# EAGLE design Quectel-1280 (EAGLE 7.6.0)
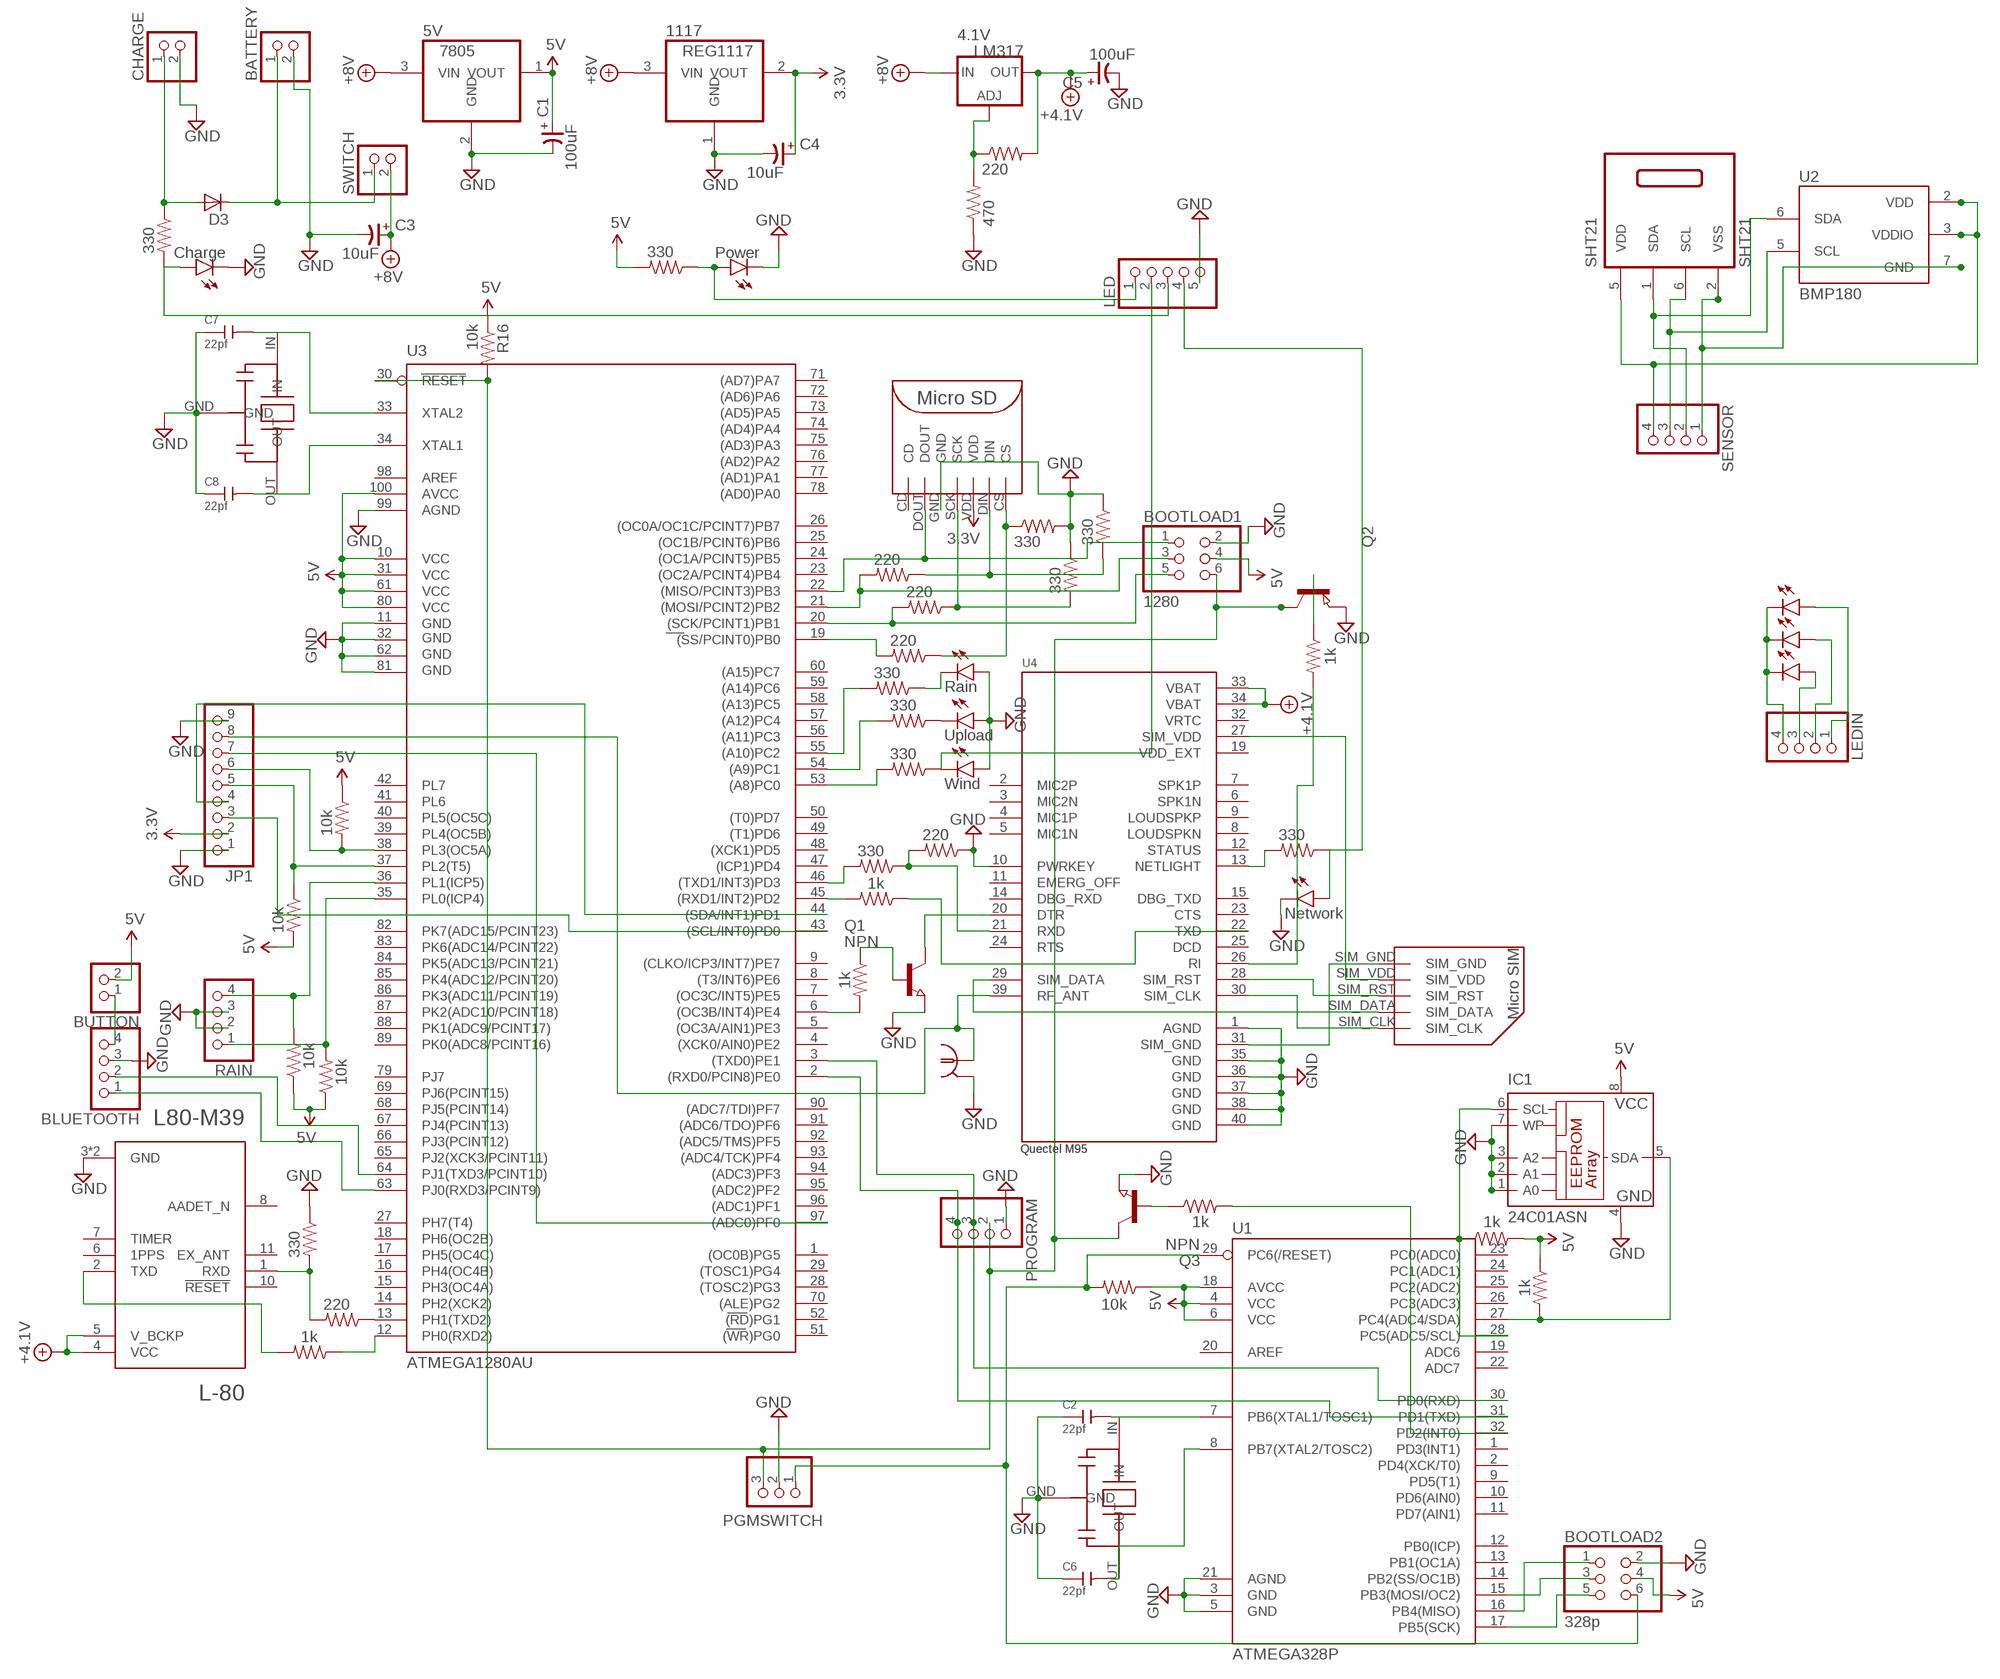
[diagram p0: schematic, sheet 1]

## Parts
4.1V  LM317  LM317MABDT  [DPACK]
5V  7805  REG1118  [SOT223]
1117  REG1117  [SOT223]
ANT  LTI-SASF54GT  [LTI-SASF54GT]
BATTERY  PINHD-1X2  [1X02]
BLUETOOTH  PINHD-1X4  [1X04]
BOOTLOAD1  1280  PINHD-2X3  [2X03]
BOOTLOAD2  328p  PINHD-2X3  [2X03]
BUTTON  PINHD-1X2  [1X02]
C1  100uF  CP-3528  [3528/T]
C2  22pf  CERAMIC-22PF-50V-5%-NPO(0805)  [C0805]
C3  10uF  CP-3528  [3528/T]
C4  10uF  CP-3528  [3528/T]
C5  100uF  CP-3528  [3528/T]
C6  22pf  CERAMIC-22PF-50V-5%-NPO(0805)  [C0805]
C7  22pf  CERAMIC-22PF-50V-5%-NPO(0805)  [C0805]
C8  22pf  CERAMIC-22PF-50V-5%-NPO(0805)  [C0805]
CHARGE  PINHD-1X2  [1X02]
D1  Charge  LED-BLUE1206  [LED-1206]
D2  Rain  LED-BLUE1206  [LED-1206]
D3  BYS10  [SOD106A]
D4  Upload  LED-BLUE1206  [LED-1206]
D5  Power  LED-BLUE1206  [LED-1206]
D6  Network  LED-BLUE1206  [LED-1206]
D7  Wind  LED-BLUE1206  [LED-1206]
D8  LED-BLUE1206  [LED-1206]
D9  LED-BLUE1206  [LED-1206]
D10  LED-BLUE1206  [LED-1206]
IC1  24C01ASN  [SO-08]
JP1  PINHD-1X9  [1X09]
L-80  L80-M39  [QUECTEL_L80-M39]
LED  PINHD-1X5  [1X05]
LEDIN  PINHD-1X4  [1X04]
PGMSWITCH  PINHD-1X3  [1X03]
PROGRAM  PINHD-1X4  [1X04]
Q1  NPN  NPN-TRANSISTOR_SOT23  [SOT23]
Q2  PNP-TRANSISTOR_SOT23  [SOT23]
Q3  NPN  NPN-TRANSISTOR_SOT23  [SOT23]
R1  10k  RESISTOR0805-RES  [0805]
R2  1k  RESISTOR0805-RES  [0805]
R3  1k  RESISTOR0805-RES  [0805]
R4  330  RESISTOR0805-RES  [0805]
R5  1k  RESISTOR0805-RES  [0805]
R6  220  RESISTOR0805-RES  [0805]
R7  220  RESISTOR0805-RES  [0805]
R8  220  RESISTOR0805-RES  [0805]
R9  330  RESISTOR0805-RES  [0805]
R10  220  RESISTOR0805-RES  [0805]
R11  470  RESISTOR0805-RES  [0805]
R12  220  RESISTOR0805-RES  [0805]
R13  1k  RESISTOR0805-RES  [0805]
R14  330  RESISTOR0805-RES  [0805]
R15  1k  RESISTOR0805-RES  [0805]
R16  10k  RESISTOR0805-RES  [0805]
R17  330  RESISTOR0805-RES  [0805]
R18  330  RESISTOR0805-RES  [0805]
R19  10k  RESISTOR0805-RES  [0805]
R20  10k  RESISTOR0805-RES  [0805]
R21  10k  RESISTOR0805-RES  [0805]
R22  10k  RESISTOR0805-RES  [0805]
R23  330  RESISTOR0805-RES  [0805]
R24  330  RESISTOR0805-RES  [0805]
R25  330  RESISTOR0805-RES  [0805]
R26  330  RESISTOR0805-RES  [0805]
R27  330  RESISTOR0805-RES  [0805]
R28  330  RESISTOR0805-RES  [0805]
R29  220  RESISTOR0805-RES  [0805]
R30  1k  RESISTOR0805-RES  [0805]
R31  1k  RESISTOR0805-RES  [0805]
RAIN  PINHD-1X4  [1X04]
SENSOR  PINHD-1X4  [1X04]
SHT21  SHT21  [DFN6/SHT]
SWITCH  PINHD-1X2  [1X02]
U1  ATMEGA328P  ATMEGA328P_TQFP  [TQFP32-08]
U2  BMP180  [BMP180]
U3  ATMEGA1280AU  ATMEGA2560AU  [TQFP100]
U4  Quectel M95  M95  [XCVR_M95]
U$1  MICROSD  [MICROSD]
U$2  MICROSIM  [MICROSIM]
Y1  CSTCE16M0V53-R0  [CFP95P160X100-3N]
Y2  CSTCE16M0V53-R0  [CFP95P160X100-3N]

## Nets
3.3V: 1117.2(VOUT) C4.+ JP1.2 U$1.VDD
5V: 5V.1(VOUT) BOOTLOAD1.4 BOOTLOAD2.4 BUTTON.2 C1.+ IC1.8(VCC) R1.1 R5.1 R16.1 R18.2 R19.1 R20.2 R21.1 R22.1 R30.2 U1.4(VCC) U1.6(VCC) U1.18(AVCC) U3.10(VCC) U3.31(VCC1) U3.61(VCC2) U3.80(VCC3) U3.100(AVCC)
+4.1V: 4.1V.4(OUT) C5.+ L-80.4(VCC) L-80.5(V_BCKP) R10.2 U4.33(VBAT) U4.34(VBAT)
+8V: 4.1V.3(IN) 5V.3(VIN) 1117.3(VIN) C3.+ SWITCH.2
GND: 5V.2(GND) 1117.1(GND) ANT.2 ANT.3 ANT.4 ANT.5 BATTERY.2 BLUETOOTH.3 BOOTLOAD1.2 BOOTLOAD2.2 C1.- C2.1 C3.- C4.- C5.- C6.1 C7.1 C8.1 CHARGE.2 D1.C D2.A D4.A D5.C D6.C D7.A IC1.1(A0) IC1.2(A1) IC1.3(A2) IC1.4(GND) IC1.7(WP) JP1.1 JP1.9 L-80.3(GND) L-80.12(GND) LED.5 PGMSWITCH.2 PROGRAM.1 Q1.2(E) Q2.2(E) Q3.2(E) R4.1 R9.1 R11.1 R23.2 R24.1 R29.1 RAIN.2 RAIN.3 U1.3(GND) U1.5(GND) U1.21(AGND) U3.11(GND) U3.32(GND1) U3.62(GND2) U3.81(GND3) U3.99(AGND) U4.1(AGND) U4.10(PWRKEY) U4.35(GND) U4.36(GND) U4.37(GND) U4.38(GND) U4.40(GND) U$1.GND Y1.GND Y2.GND
GNDLED: D8.C D9.C D10.C LEDIN.4
GNDSENSOR: SENSOR.1 SHT21.2(VSS) U2.7(GND)
N$1: U4.31(SIM_GND) U$2.SIM_GND
N$2: U4.27(SIM_VDD) U$2.SIM_VDD
N$3: U4.28(SIM_RST) U$2.SIM_RST
N$4: U4.29(SIM_DATA) U$2.SIM_DATA
N$5: ANT.1 JP1.8 U4.39(RF_ANT)
N$6: U4.30(SIM_CLK) U$2.SIM_CLK
N$7: L-80.2(TXD) R13.2
N$8: PROGRAM.4 U1.31(PD1(TXD)) U3.2((RXD0/PCIN8)PE0)
N$9: PROGRAM.3 U1.30(PD0(RXD)) U3.3((TXD0)PE1)
N$10: R7.1 R24.2 U$1.SCK
N$11: BOOTLOAD1.1 U3.22((MISO/PCINT3)PB3) U$1.DOUT
N$12: R6.1 R9.2 U$1.DIN
N$13: C2.2 U1.7(PB6(XTAL1/TOSC1)) Y1.IN
N$14: R2.2 U3.6((OC3B/INT4)PE4)
N$15: Q1.1(B) R2.1
N$16: BOOTLOAD1.3 R6.2 U3.21((MOSI/PCINT2)PB2)
N$17: BOOTLOAD1.5 R7.2 U3.20((SCK/PCINT1)PB1)
N$18: R3.2 U4.26(RI)
N$19: BATTERY.1 D3.K SWITCH.1
N$20: R8.2 U3.19((SS/PCINT0)PB0)
N$21: BOOTLOAD2.1 U1.16(PB4(MISO))
N$22: BOOTLOAD2.3 U1.15(PB3(MOSI/OC2))
N$23: BOOTLOAD2.5 U1.17(PB5(SCK))
N$24: C6.2 U1.8(PB7(XTAL2/TOSC2)) Y1.OUT
N$25: CHARGE.1 D3.A R26.1
N$26: BOOTLOAD2.6 PGMSWITCH.1 R1.2 U1.29(PC6(/RESET))
N$27: D1.A LED.3 R26.2
N$28: Q2.1(B) R3.1
N$29: 4.1V.1(ADJ) R10.1 R11.2
N$30: C7.2 U3.33(XTAL2) Y2.IN
N$31: C8.2 U3.34(XTAL1) Y2.OUT
N$32: D7.C LED.2 R28.1
N$33: D4.C R25.1
N$34: D2.C R27.1
N$35: R8.1 R23.1 U$1.CS
N$36: R12.1 U3.13(PH1(TXD2))
N$37: R13.1 U3.12(PH0(RXD2))
N$38: L-80.1(RXD) R4.2 R12.2
N$39: R28.2 U3.53((A8)PC0)
N$40: R14.2 U3.46((TXD1/INT3)PD3)
N$41: R15.2 U3.45((RXD1/INT2)PD2)
N$42: R14.1 R29.2 U4.21(RXD)
N$43: R15.1 U4.22(TXD)
N$44: IC1.5(SDA) R5.2 U1.27(PC4(ADC4/SDA))
N$45: R25.2 U3.54((A9)PC1)
N$46: Q1.3(C) U4.20(DTR)
N$47: BOOTLOAD1.6 PGMSWITCH.3 PROGRAM.2 Q2.3(C) Q3.3(C) R16.2 U3.30(RESET)
N$48: R27.2 U3.55((A10)PC2)
N$49: IC1.6(SCL) R30.1 U1.28(PC5(ADC5/SCL))
N$50: R17.2 U4.13(NETLIGHT)
N$51: D6.A LED.4 R17.1
N$52: Q3.1(B) R31.1
N$53: JP1.3 U3.43((SCL/INT0)PD0)
N$54: JP1.4 U3.44((SDA/INT1)PD1)
N$55: JP1.5 R20.1 U3.37(PL2(T5))
N$56: JP1.6 R19.2 U3.38(PL3(OC5A))
N$57: JP1.7 U3.97((ADC0)PF0)
N$58: R21.2 RAIN.4 U3.36(PL1(ICP5))
N$59: R22.2 RAIN.1 U3.35(PL0(ICP4))
N$60: D5.A LED.1 R18.1
N$61: R31.2 U1.32(PD2(INT0))
N$62: BLUETOOTH.2 U3.64(PJ1(TXD3/PCINT10))
N$63: SENSOR.2 SHT21.1(SDA) U2.6(SDA)
N$64: SENSOR.3 SHT21.6(SCL) U2.5(SCL)
N$65: SENSOR.4 SHT21.5(VDD) U2.2(VDD) U2.3(VDDIO)
N$66: BLUETOOTH.1 U3.63(PJ0(RXD3/PCINT9))
N$67: D10.A LEDIN.3
N$68: D8.A LEDIN.2
N$69: D9.A LEDIN.1
N$70: BLUETOOTH.4 BUTTON.1
Unconnected: L-80.6(1PPS) L-80.7(TIMER) L-80.8(AADET_N) L-80.10(!RESET) L-80.11(EX_ANT) U1.1(PD3(INT1)) U1.2(PD4(XCK/T0)) U1.9(PD5(T1)) U1.10(PD6(AIN0)) U1.11(PD7(AIN1)) U1.12(PB0(ICP)) U1.13(PB1(OC1A)) U1.14(PB2(SS/OC1B)) U1.19(ADC6) U1.20(AREF) U1.22(ADC7) U1.23(PC0(ADC0)) U1.24(PC1(ADC1)) U1.25(PC2(ADC2)) U1.26(PC3(ADC3)) U3.1((OC0B)PG5) U3.4((XCK0/AIN0)PE2) U3.5((OC3A/AIN1)PE3) U3.7((OC3C/INT5)PE5) U3.8((T3/INT6)PE6) U3.9((CLKO/ICP3/INT7)PE7) U3.14(PH2(XCK2)) U3.15(PH3(OC4A)) U3.16(PH4(OC4B)) U3.17(PH5(OC4C)) U3.18(PH6(OC2B)) U3.23((OC2A/PCINT4)PB4) U3.24((OC1A/PCINT5)PB5) U3.25((OC1B/PCINT6)PB6) U3.26((OC0A/OC1C/PCINT7)PB7) U3.27(PH7(T4)) U3.28((TOSC2)PG3) U3.29((TOSC1)PG4) U3.39(PL4(OC5B)) U3.40(PL5(OC5C)) U3.41(PL6) U3.42(PL7) U3.47((ICP1)PD4) U3.48((XCK1)PD5) U3.49((T1)PD6) U3.50((T0)PD7) U3.51((WR)PG0) U3.52((RD)PG1) U3.56((A11)PC3) U3.57((A12)PC4) U3.58((A13)PC5) U3.59((A14)PC6) U3.60((A15)PC7) U3.65(PJ2(XCK3/PCINT11)) U3.66(PJ3(PCINT12)) U3.67(PJ4(PCINT13)) U3.68(PJ5(PCINT14)) U3.69(PJ6(PCINT15)) U3.70((ALE)PG2) U3.71((AD7)PA7) U3.72((AD6)PA6) U3.73((AD5)PA5) U3.74((AD4)PA4) U3.75((AD3)PA3) U3.76((AD2)PA2) U3.77((AD1)PA1) U3.78((AD0)PA0) U3.79(PJ7) U3.82(PK7(ADC15/PCINT23)) U3.83(PK6(ADC14/PCINT22)) U3.84(PK5(ADC13/PCINT21)) U3.85(PK4(ADC12/PCINT20)) U3.86(PK3(ADC11/PCINT19)) U3.87(PK2(ADC10/PCINT18)) U3.88(PK1(ADC9/PCINT17)) U3.89(PK0(ADC8/PCINT16)) U3.90((ADC7/TDI)PF7) U3.91((ADC6/TDO)PF6) U3.92((ADC5/TMS)PF5) U3.93((ADC4/TCK)PF4) U3.94((ADC3)PF3) U3.95((ADC2)PF2) U3.96((ADC1)PF1) U3.98(AREF) U4.2(MIC2P) U4.3(MIC2N) U4.4(MIC1P) U4.5(MIC1N) U4.6(SPK1N) U4.7(SPK1P) U4.8(LOUDSPKN) U4.9(LOUDSPKP) U4.11(EMERG_OFF) U4.12(STATUS) U4.14(DBG_RXD) U4.15(DBG_TXD) U4.23(CTS) U4.24(RTS) U4.25(DCD) U$1.CD

## Power pins joined to a net without a drawn wire
VDD_EXT: U4.19(VDD_EXT)
VRTC: U4.32(VRTC)

## Library data of the parts
4.1V = v-reg:LM317?*: 500 mA Adjustable Output Positive Voltage Regulator Source: http://www.onsemi.co.jp .. LM317M-D.PDF
5V = burr-brown:REG1118: 800mA Low Dropout (LDO) Positive Regulator with Current Source and Sink Capability; MPN: 7805; OC_FARNELL: unknown; OC_NEWARK: 14M2185
1117 = burr-brown:REG1117: 800mA and 1A Low Dropout (LDO) Positive Regulator 1.8V, 2.5V, 2.85V, 3.3V, 5V, and Adj; MPN: REG1117; OC_FARNELL: 1097566; OC_NEWARK: 14P6981
ANT = con-coax:LTI-SASF54GT: SMA vertical PCB thrue hole jack Source: Lighthorse Technologies, inc. SASF54GT.pdf; OC_FARNELL: unknown; OC_NEWARK: unknown
BATTERY BUTTON CHARGE SWITCH = pinhead:PINHD-1X2: PIN HEADER
BLUETOOTH LEDIN PROGRAM RAIN SENSOR = pinhead:PINHD-1X4: PIN HEADER
BOOTLOAD1 BOOTLOAD2 = pinhead:PINHD-2X3: PIN HEADER
C1 C3-C5 = cap-master:CP-: POLARIZED CAP
C2 C6-C8 = Seeed-OPL-Capacitor:CERAMIC-22PF-50V-5%-NPO(0805): 302010151; MPN: CC0805JRNPO9BN220
D1 D2 D4-D10 = SparkFun-LED:LED-BLUE: Blue LEDs for production use Various blue LEDs stocked by SparkFun production 0603 - DIO-08575 Rebel - DIO-09553 1206 - DIO-09911; PROD_ID: DIO-09911; VALUE: BLUE
D3 = telefunken:BYS10: DIODE; MPN: BYS10/45; OC_FARNELL: 9549188; OC_NEWARK: 96K7236
IC1 = microchip:24C*: Serial EEPROM 1 K/2 K/4 K; MPN: AT24C01BN-SH-B; OC_FARNELL: 1362638; OC_NEWARK: 50M3313
JP1 = pinhead:PINHD-1X9: PIN HEADER
L-80 = L80-M39:L80-M39: GPS Receiver 1575.42MHz 3.3V 12-Pin
LED = pinhead:PINHD-1X5: PIN HEADER
PGMSWITCH = pinhead:PINHD-1X3: PIN HEADER
Q1 Q3 = semicon-smd-ipc:NPN-TRANSISTOR_: NPN TRANSISTOR
Q2 = semicon-smd-ipc:PNP-TRANSISTOR_: PNP TRANSISTOR
R1-R31 = SparkFun-Resistors:RESISTOR: Resistor Basic schematic elements and footprints for 0603, 1206, and PTH resistors.
SHT21 = sensirion:SHT21: Humidity and Temperature Sensor
U1 = SparkFun-DigitalIC:ATMEGA328P_TQFP; PROD_ID: IC-09069; VALUE: ATMEGA328P_TQFP
U2 = SparkFun-Sensors:BMP180: BOSCH BMP180 DIGITAL BAROMETRIC PRESSURE SENSOR Web page: http://www.bosch-sensortec.com/en/homepage/products_3/environmental_sensors_1/bmp180_1/bmp180 Datasheet: http://ae-bst.resource.bosch.com/media/products/dokumente/bmp180/BST-BMP180-DS000-09.pdf The BMP180 is the function compatible successor of the BMP085, a new generation of high precision digital pressure sensors for consumer applications. The ultra-low power, low voltage electronics of the BMP180 is optimized for use in mobile phones, PDAs, GPS navigation devices and outdoor equipment. With a low altitude noise of merely 0.25m at fast conversion time, the BMP180 offers superior performance. The I2C interface allows for easy system integration with a microcontroller. The BMP180 is based on piezo-resistive technology for EMC robustness, high accuracy and linearity as well as long term stability. Key features: - Temperature measurement included - I2C interface - Fully calibrated - Pb-free, halogen-free and RoHS compliant, - MSL 1 Basic specs: Pressure range: 300 to 1100hPa (+9000m to -500m relating to sea level) Supply voltage: 1.8 to 3.6V (VDD), 1.62V to 3.6V (VDDIO) Package: LGA package with metal lid Small footprint: 3.6mm x 3.8mm Super-flat: 0.93mm height Low power: 5μA at 1 sample / sec. in standard mode Low noise: 0.06hPa (0.5m) in ultra low power mode, 0.02hPa (0.17m) advanced resolution mode Typical applications: - Enhancement of GPS navigation (dead-reckoning, slope detection, etc.) - In- and out-door navigation - Leisure and sports - Weather forecast - Vertical velocity indication (rise/sink speed)
U3 = SparkFun-DigitalIC:ATMEGA2560: Atmel 100-pin 8-bit uC 64/128/256 Kbytes FLASH 4 Kbytes EEPROM 8 Kbytes SRAM 86 General Purpose I/O pins 12-channels16-bit PWM 4 x Serial USARTs 16-channels 10-bit A/D; PROD_ID: IC-10040
U4 = M95:M95: Quad-Band GSM/GPRS Module LCC
U$1 = MicroSD:MICROSD
U$2 = MicroSD:MICROSIM
Y1 Y2 = smd-crystal:CSTCE16M0V53-R0: Ceramic Resonator 16MHz ±0.5% (Tol) ±0.3% (Stability) 15pF 40Ohm 3-Pin CSMD T/R

## Net classes
0 default: clearance 0.205 mm

## Board
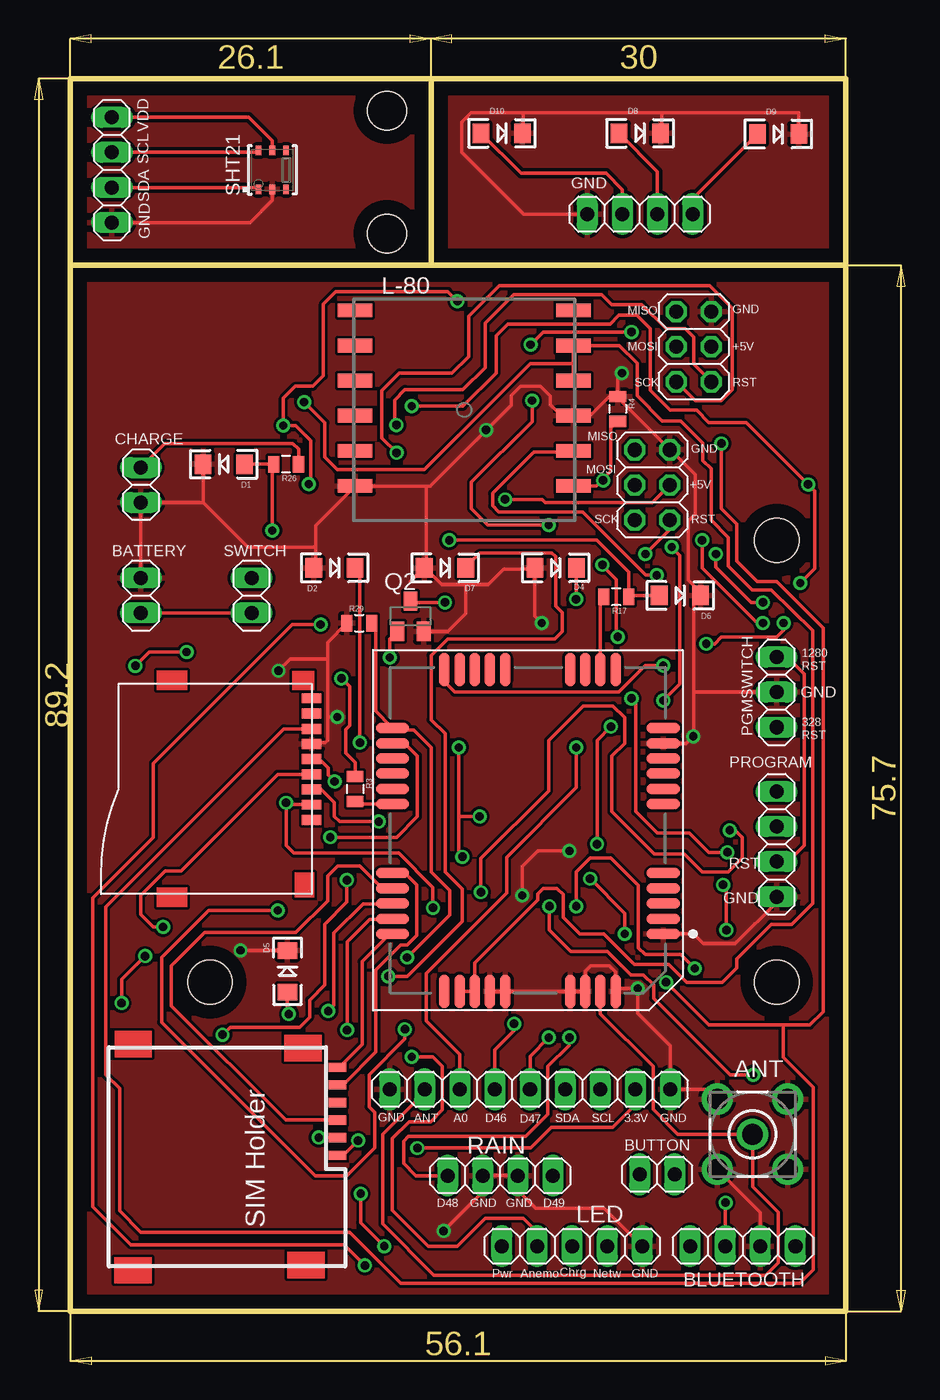
[diagram p1: board, top side]
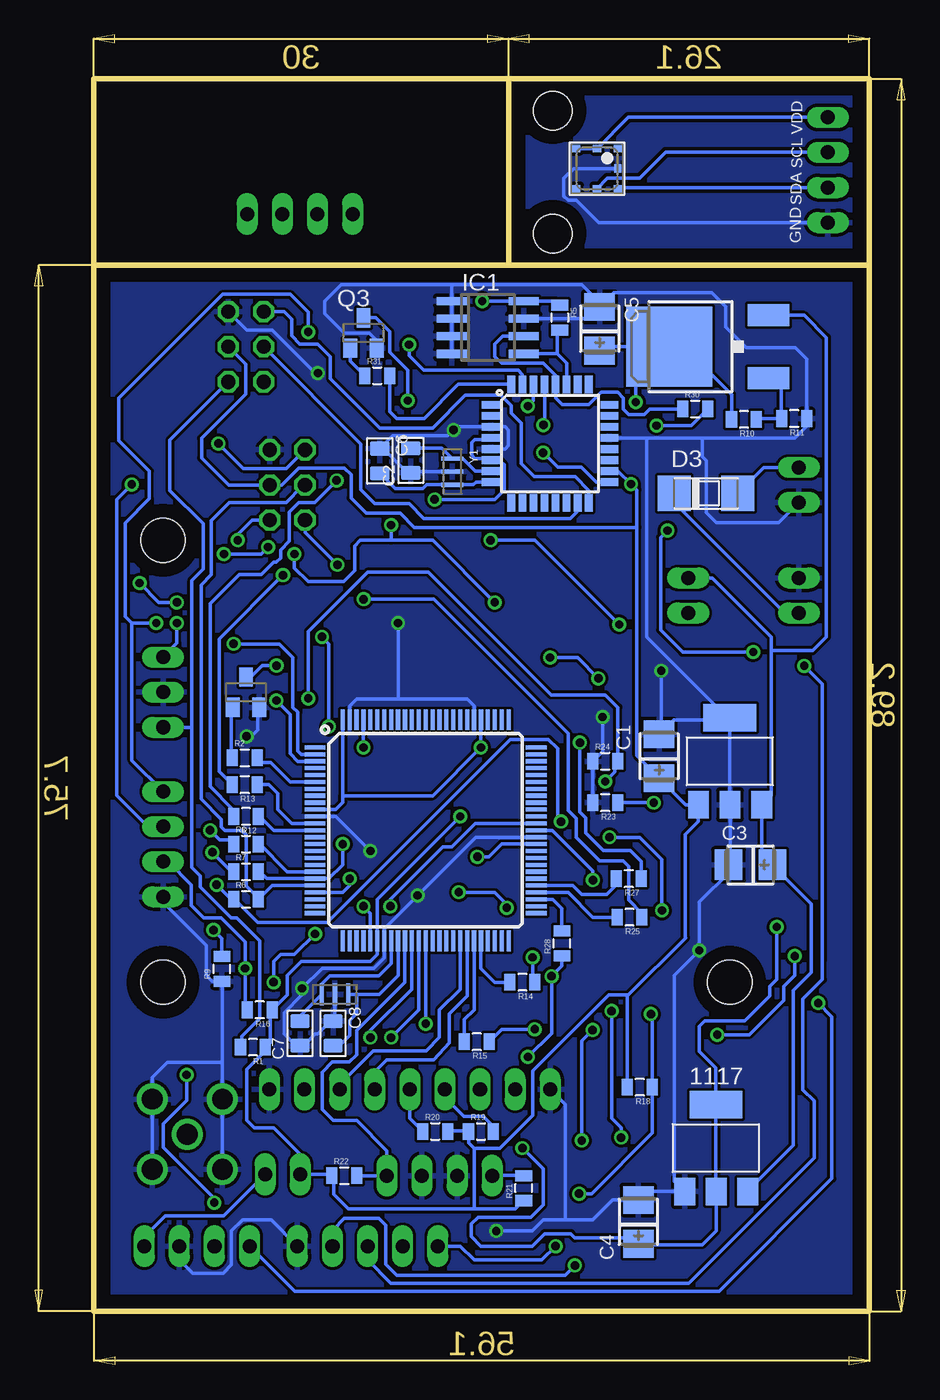
[diagram p2: board, bottom side, seen from below]

Size 56.1 x 89.2 mm. Coordinates in mm from the lower left corner, seen from the top.
Outline: 56.1,75.7 56.1,0 0,0 0,75.7
Outline: 0,75.7 26.1,75.7
Outline: 26.1,75.7 56.1,75.7
Outline: 56.1,75.7 56.1,89.2 26.1,89.2
Outline: 26.1,89.2 0,89.2 0,75.7
Outline: 26.1,75.7 26.1,89.2
Copper layers (1*16): Top 0.035mm / dielectric 1.5mm / Bottom 0.035mm
Design rules "default": minimum track width 10mil, minimum drill 24mil, track to track 8mil, track to pad 8mil, pad to pad 8mil, via to via 8mil, smd to smd 8mil, copper to edge 40mil, drill to drill 8mil, minimum pad ring 10mil, minimum via ring 8mil, stop-mask expansion 4mil, vias tented up to drill 0mil, thermal gap 10mil
Holes 3.2 mm at 10.1,23.8 51.1,55.8 51.1,23.8
Holes 2.8 mm at 22.9,86.9 22.9,78

### Footprints (pad centres in the part's own frame; a part is rotated, then mirrored left to right if it is on the bottom)
DPACK = smd 1.6 x 3: 1 -2.28,-4.8; 3 2.28,-4.8 | smd 5.8 x 6.2: 4 0,2.38
SOT223 = smd 1.499 x 2.007: 1 -2.261,-3.15; 2 0.025,-3.15; 3 2.311,-3.15 | smd 3.81 x 2.007: 4 0,3.15
LTI-SASF54GT = drill 1.5 pad 2.2: 1 0,0; 2 -2.54,2.54; 3 2.54,2.54; 4 2.54,-2.54; 5 -2.54,-2.54
1X02 = drill 1.016 long: 1 -1.27,0; 2 1.27,0
1X04 = drill 1.016 long: 1 -3.81,0; 2 -1.27,0; 3 1.27,0; 4 3.81,0
2X03 = drill 1.016 octagon: 1 -2.54,-1.27; 2 -2.54,1.27; 3 0,-1.27; 4 0,1.27; 5 2.54,-1.27; 6 2.54,1.27
3528/T = smd 2 x 2.2: + 1.587,0; - -1.587,0
C0805 = smd 1.397 x 1.016: 1 0,0.889; 2 0,-0.889
LED-1206 = smd 1.2 x 1.4: A -1.5,0; C 1.5,0
SOD106A = smd 2.4 x 2.6: A 2.3,0; K -2.3,0
SO-08 = smd 0.6 x 2.2: 1 -1.905,-2.6; 2 -0.635,-2.6; 3 0.635,-2.6; 4 1.905,-2.6; 5 1.905,2.6; 6 0.635,2.6; 7 -0.635,2.6; 8 -1.905,2.6
1X09 = drill 1.016 long: 1 -10.16,0; 2 -7.62,0; 3 -5.08,0; 4 -2.54,0; 5 0,0; 6 2.54,0; 7 5.08,0; 8 7.62,0; 9 10.16,0
QUECTEL_L80-M39 = smd 2.5 x 1: 1 7.9,-5.5; 2 7.9,-2.96; 3 7.9,-0.42; 4 7.9,2.12; 5 7.9,4.66; 6 7.9,7.2; 7 -7.9,7.2; 8 -7.9,4.66; 9 -7.9,2.12; 10 -7.9,-0.42; 11 -7.9,-2.96; 12 -7.9,-5.5
1X05 = drill 1.016 long: 1 -5.08,0; 2 -2.54,0; 3 0,0; 4 2.54,0; 5 5.08,0
1X03 = drill 1.016 long: 1 -2.54,0; 2 0,0; 3 2.54,0
SOT23 = smd 1 x 1.4: 1 -0.95,-1.1; 2 0.95,-1.1; 3 0,1.1
0805 = smd 0.8 x 1.2: 1 -0.9,0; 2 0.9,0
DFN6/SHT = smd 0.4 x 0.7: 1 -1,-1.4; 2 0,-1.4; 3 1,-1.4; 4 1,1.4; 5 0,1.4; 6 -1,1.4
TQFP32-08 = smd 1.27 x 0.559: 1 -4.293,2.8; 2 -4.293,2; 3 -4.293,1.2; 4 -4.293,0.4; 5 -4.293,-0.4; 6 -4.293,-1.2; 7 -4.293,-2; 8 -4.293,-2.8; 17 4.293,-2.8; 18 4.293,-2; 19 4.293,-1.2; 20 4.293,-0.4; 21 4.293,0.4; 22 4.293,1.2; 23 4.293,2; 24 4.293,2.8 | smd 0.559 x 1.27: 9 -2.8,-4.293; 10 -2,-4.293; 11 -1.2,-4.293; 12 -0.4,-4.293; 13 0.4,-4.293; 14 1.2,-4.293; 15 2,-4.293; 16 2.8,-4.293; 25 2.8,4.293; 26 2,4.293; 27 1.2,4.293; 28 0.4,4.293; 29 -0.4,4.293; 30 -1.2,4.293; 31 -2,4.293; 32 -2.8,4.293
BMP180 = smd 0.6 x 0.5: 1 1.5,1.45; 2 0,1.45; 3 -1.5,1.45; 4 -1.5,-1.45; 5 0,-1.45; 6 1.5,-1.45 | smd 0.5 x 0.6: 7 1.5,0
TQFP100 = smd 1.5 x 0.3: 1 -8,6; 2 -8,5.5; 3 -8,5; 4 -8,4.5; 5 -8,4; 6 -8,3.5; 7 -8,3; 8 -8,2.5; 9 -8,2; 10 -8,1.5; 11 -8,1; 12 -8,0.5; 13 -8,0; 14 -8,-0.5; 15 -8,-1; 16 -8,-1.5; 17 -8,-2; 18 -8,-2.5; 19 -8,-3; 20 -8,-3.5; 21 -8,-4; 22 -8,-4.5; 23 -8,-5; 24 -8,-5.5; 25 -8,-6; 51 8,-6; 52 8,-5.5; 53 8,-5; 54 8,-4.5; 55 8,-4; 56 8,-3.5; 57 8,-3; 58 8,-2.5; 59 8,-2; 60 8,-1.5; 61 8,-1; 62 8,-0.5; 63 8,0; 64 8,0.5; 65 8,1; 66 8,1.5; 67 8,2; 68 8,2.5; 69 8,3; 70 8,3.5; 71 8,4; 72 8,4.5; 73 8,5; 74 8,5.5; 75 8,6 | smd 0.3 x 1.5: 26 -6,-8; 27 -5.5,-8; 28 -5,-8; 29 -4.5,-8; 30 -4,-8; 31 -3.5,-8; 32 -3,-8; 33 -2.5,-8; 34 -2,-8; 35 -1.5,-8; 36 -1,-8; 37 -0.5,-8; 38 0,-8; 39 0.5,-8; 40 1,-8; 41 1.5,-8; 42 2,-8; 43 2.5,-8; 44 3,-8; 45 3.5,-8; 46 4,-8; 47 4.5,-8; 48 5,-8; 49 5.5,-8; 50 6,-8; 76 6,8; 77 5.5,8; 78 5,8; 79 4.5,8; 80 4,8; 81 3.5,8; 82 3,8; 83 2.5,8; 84 2,8; 85 1.5,8; 86 1,8; 87 0.5,8; 88 0,8; 89 -0.5,8; 90 -1,8; 91 -1.5,8; 92 -2,8; 93 -2.5,8; 94 -3,8; 95 -3.5,8; 96 -4,8; 97 -4.5,8; 98 -5,8; 99 -5.5,8; 100 -6,8
XCVR_M95 = smd 2.4 x 0.75: 1 -9.8,7.5; 2 -9.8,6.4; 3 -9.8,5.3; 4 -9.8,4.2; 5 -9.8,3.1; 6 -9.8,-1.9; 7 -9.8,-3; 8 -9.8,-4.1; 9 -9.8,-5.2; 10 -9.8,-6.3; 11 -9.8,-7.4; 21 9.8,-7.4; 22 9.8,-6.3; 23 9.8,-5.2; 24 9.8,-4.1; 25 9.8,-3; 26 9.8,-1.9; 27 9.8,3.1; 28 9.8,4.2; 29 9.8,5.3; 30 9.8,6.4; 31 9.8,7.5 | smd 0.75 x 2.4: 12 -6.35,-11.65; 13 -5.25,-11.65; 14 -4.15,-11.65; 15 -3.05,-11.65; 16 1.65,-11.65; 17 2.75,-11.65; 18 3.85,-11.65; 19 4.95,-11.65; 20 6.05,-11.65; 32 6.05,11.65; 33 4.95,11.65; 34 3.85,11.65; 35 2.75,11.65; 36 1.65,11.65; 37 -3.05,11.65; 38 -4.15,11.65; 39 -5.25,11.65; 40 -6.35,11.65
MICROSD = smd 1.422 x 0.711: CD -6.35,-6.553; CS -6.35,1.143; DIN -6.35,0.051; DOUT -6.35,-4.343; GND -6.35,-3.251; P$3 -6.35,2.261; P$8 -6.35,-4.343; P$9 -6.35,-4.343; P$10 -6.35,-5.461; SCK -6.35,-2.159; VDD -6.35,-1.041
MICROSIM = smd 0.66 x 1.27: NC -3.29,9.23; SIM_CLK 0.515,9.23; SIM_DATA -0.76,9.23; SIM_GND -5.83,9.23; SIM_RST -2.025,9.23; SIM_VDD -4.565,9.23
CFP95P160X100-3N = smd 0.3 x 1.6: GND 0.038,0.175; IN -0.912,0.177; OUT 0.992,0.174

### Placement (x,y rotation side)
4.1V  12.1,69.8 90 bottom
5V  10.1,39.8 0 bottom
1117  11.1,11.8 0 bottom
ANT  49.35,12.8 0 top
BATTERY  5.1,51.8 90 top
BLUETOOTH  48.65,4.7 0 top
BOOTLOAD1  42.1,59.8 270 top
BOOTLOAD2  45.1,69.8 270 top
BUTTON  42.45,9.9 180 top
C1  15.21,40.16 270 bottom
C2  33.17,61.57 180 bottom
C3  8.6,32.3 0 bottom
C4  16.71,6.46 270 bottom
C5  19.51,71.11 270 bottom
C6  35.42,61.54 0 bottom
C7  41.19,20.1 180 bottom
C8  38.8,20.1 0 bottom
CHARGE  5.1,59.8 270 top
D1  11.1,61.3 180 top
D2  19.1,53.8 0 top
D3  11.81,59.19 0 bottom
D4  35.1,53.8 0 top
D5  15.7,24.6 90 top
D6  44.1,51.8 0 top
D7  27.1,53.8 0 top
D8  41.2,85.25 0 top
D9  51.2,85.2 0 top
D10  31.2,85.25 0 top
IC1  27.6,71.2 270 bottom
JP1  33.25,16.05 180 top
L-80  28.49,65.23 0 top
LED  36.3,4.7 0 top
LEDIN  41.2,79.4 180 top
PGMSWITCH  51.1,44.8 90 top
PROGRAM  51.1,33.8 90 top
Q1  45.1,44.8 0 bottom
Q2  24.6,50.3 0 top
Q3  36.6,70.8 0 bottom
R1  44.6,19.1 180 bottom
R2  45.2,40.05 0 bottom
R3  20.6,37.8 270 top
R4  39.6,65.3 270 top
R5  22.4,71.9 270 bottom
R6  45.1,29.8 0 bottom
R7  45.1,31.8 0 bottom
R8  45.1,33.8 0 bottom
R9  46.85,24.77 90 bottom
R10  9.07,64.54 180 bottom
R11  5.44,64.6 180 bottom
R12  45.1,35.8 180 bottom
R13  45.2,38.1 180 bottom
R14  25.1,23.8 180 bottom
R15  28.4,19.5 180 bottom
R16  44.1,21.8 180 bottom
R17  39.5,51.7 180 top
R18  16.6,16.2 180 bottom
R19  28.1,13 0 bottom
R20  31.4,13 0 bottom
R21  25,8.9 90 bottom
R22  38,9.8 0 bottom
R23  19.1,36.8 180 bottom
R24  19.1,39.8 0 bottom
R25  17.35,28.5 180 bottom
R26  15.6,61.3 180 top
R27  17.4,31.3 180 bottom
R28  22.24,26.61 90 bottom
R29  20.9,49.8 0 top
R30  12.6,65.3 0 bottom
R31  35.6,67.7 0 bottom
RAIN  31.1,9.8 180 top
SENSOR  3,82.6 90 top
SHT21  14.6,82.6 0 top
SWITCH  13.1,51.8 90 top
U1  23.1,62.8 0 bottom
U2  19.7,82.7 0 bottom
U3  32.1,34.8 0 bottom
U4  33.1,34.8 180 top
U$1  11.1,37.8 180 top
U$2  10.1,11.8 270 top
Y1  30.35,60.8 270 bottom
Y2  38.7,22.75 0 bottom

### Tracks (layer width: path | path; a pad name or v marks a point on that pad's centre or on a via)
3.3V  (via drill 0.6)
  Top 0.254: v25.1,11.8 33.3,11.8 34.8,13.3 39.25,13.3 40.87,14.92 JP1.2 | U$1.VDD 14.99,38.84 8.02,31.87 6.87,31.87 5.1,30.1 5.1,28.7 6,27.8 v6.7,27.8
  Bottom 0.254: v25.1,11.8 23.6,10.3 23.6,7.7 24.5,6.8 28.3,6.8 28.8,6.3 28.8,5.4 28.1,4.7 24.4,4.7 23.5,5.6 21.6,5.6 21.3,5.3 17.14,5.3 C4.+ 16.64,4.8 12.1,4.8 11.07,5.82 1117.2 11.1,8.68 11.1,17.6 12.3,18.8 12.3,20.6 11.9,21 9,21 7.2,22.8 7.2,23.5 6.7,24 v6.7,27.8 6.7,27.6
5V  (via drill 0.6, 0.61)
  Top 0.254: v28.1,40.8 28.1,35.8 | v29.6,35.8 28.1,35.8 | v28,73.1 27.3,73.8 19.2,73.8 18.3,72.9 18.3,67.7 17.54,66.94 16.27,66.94 15.4,66.07 v15.4,64.1 16.3,64.1 17.4,63 17.4,60.02 v17.24,59.86 | BOOTLOAD1.4 42.09,58.52 34.35,58.52 34.12,58.75 v31.45,58.75 | 28.1,35.8 28.1,33.14 v28.36,32.88
  Bottom 0.254: 28.71,12.57 28.94,12.8 R19.1 | 25.05,7.77 R21.1 25.6,7.4 28.6,7.4 | 30.54,12.8 R20.2 30.31,13.03 29.16,13.03 R19.1 | U1.4 27.56,63.09 28.55,63.09 28.78,62.86 28.78,61.95 28.55,61.72 27.56,61.72 U1.6 27.34,61.49 26.65,61.49 26.42,61.26 26.42,59.44 27.11,58.75 v31.45,58.75 | 16.82,56.72 16.82,40.23 15.22,38.63 C1.+ 13.29,36.65 5V.1 12.36,35.44 13.3,34.5 13.3,27.02 13.29,27.01 17.5,22.8 | 16.82,56.72 16.82,59.44 v17.24,59.86 18.19,60.81 18.65,60.81 U1.18 | 16.82,56.72 32.92,56.72 33.95,57.75 36.4,57.75 37.5,58.85 37.5,60.55 37.99,61.04 41.28,61.04 42.52,59.8 BOOTLOAD1.4 46.36,59.8 48.32,61.76 48.32,63.18 45.11,66.39 45.11,68.54 BOOTLOAD2.4 | 28.6,7.4 37.7,7.4 38.77,8.47 38.77,9.83 R22.1 38.9,9.9 BUTTON.2 41.18,11.33 43.1,13.25 44.5,13.25 45.05,13.8 45.05,17.49 43.57,18.97 R1.1 43.57,19.2 43.34,19.43 43.34,21.72 R16.1 42.1,22.9 42.1,24.3 41.1,25.3 36.1,25.3 35.6,25.8 U3.31 35.6,29.8 v29.6,35.8 | U3.80 v28.1,40.8 31.6,37.3 38.1,37.3 U3.100 38.1,36.8 38.6,36.3 U3.10 | U3.61 26.6,33.8 27.52,32.88 v28.36,32.88 | 28.6,11.78 28.6,7.4 | v28,73.1 25.7,73.1 IC1.8 22.7,73.1 R5.1 | R30.2 12.9,64.1 v15.4,64.1 | 28.6,11.78 26.76,11.78 24.36,14.17 24.36,17.37 18.84,22.9 17.5,22.9 17.5,22.8 | 28.6,11.78 29,12.18 R19.1 | 17.5,22.8 R18.2
+4.1V  (via drill 0.6)
  Top 0.254: L-80.5 L-80.4 36.48,67.21 36.4,67.29 36.4,68.58 | U4.33 U4.34 29.25,25.2 33.8,29.75 33.8,30.2 34.2,30.6 35.2,30.6 35.65,30.15 35.65,28.5 36.85,27.3 38.6,27.3 40.8,25.1 43.3,25.1 44.6,23.8 47.15,23.8 48.2,24.85 48.2,25.5 50.7,28 52.2,28 53.73,29.53 53.73,49.28 50.7,52.2 49.33,52.2 47.6,53.93 47.6,56 46.35,57.25 46.35,60.97 45.76,61.56 45.76,62.82 44.15,64.43 42.83,64.43 41,66.26 41,68.6 39.7,69.9 L-80.5 36.4,68.58 | v16.9,65.8 18.4,64.3 18.4,61.8 19.3,60.9 25.6,60.9 33.28,68.58 36.4,68.58
  Bottom 0.254: C5.+ 19.23,69.8 16.9,69.8 | 16.9,69.8 4.1V.4 13.42,69.8 9.97,66.35 R10.2 | v16.9,65.8 16.9,69.8
+8V
  Bottom 0.254: SWITCH.2 11.37,53.07 7.1,48.8 7.1,47.8 | 7.1,47.8 7.1,37.34 5V.3 7.79,32.3 C3.+ 4.2,29.49 4.2,24.5 5.5,23.2 5.5,12 8.79,8.71 1117.3 | 6.38,72.08 4.1V.3 4.71,72.08 3.1,70.47 3.1,48.8 4.1,47.8 7.1,47.8
GND  (via drill 0.6, 0.61)
  Top 0.254: BATTERY.2 CHARGE.2 9.6,58.53 | 25.73,59.73 26.03,59.73 v30.08,63.78 31.88,65.58 31.88,66.25 32.59,66.96 33.98,66.96 34.7,66.24 34.7,65.6 35.5,64.8 L-80.3 37.6,64.8 39,66.2 R4.1 | 25.73,59.73 L-80.12 17.73,56.87 17.73,55.3 | U4.35 U4.36 U4.37 U4.38 37.1,23.3 37.25,23.45 37.25,24.6 37.65,25 39,25 39.45,24.55 U4.40 39.65,23.35 v41.05,23.35 41.05,21.55 43.41,19.19 JP1.1 46.1,16.05 ANT.2 | D6.C 45.1,51.3 45.1,44.8 | PGMSWITCH.2 45.1,44.8 | D1.C 9.6,58.53 | 45.2,51.89 D6.C | U$1.GND 17.51,41.15 18.45,41.15 18.6,41.3 18.6,42.9 | 25.73,59.73 25.73,53.95 D7.A | 28.6,52.58 26.88,52.58 25.73,53.72 D7.A | 28.6,52.58 30.21,52.58 31.36,53.72 33.51,53.72 D4.A 33.6,50.3 v34.1,49.8 | 17.73,55.3 17.73,53.95 D2.A | R4.1 39.68,66.06 43.34,62.41 BOOTLOAD1.2 43.57,62.18 45.2,60.55 45.2,57.7 44.7,57.2 44.7,52.9 45.6,52 D6.C | 18.6,42.9 18.6,47.2 | 18.6,47.2 18.6,48.4 R29.1 | 24.6,52.8 D7.A | 9.6,58.53 12.83,55.3 17.73,55.3 | v39.9,67.9 39.6,67.6 R4.1 | Q2.2 27.3,49.2 28.6,50.5 28.6,52.58 | U4.10 44.55,41.1 v45.06,41.61 45.1,41.65 45.1,44.8 | v27,5.8 29.83,8.63 RAIN.3 29.85,9.83 32.37,9.83 RAIN.2 32.37,8.73 33.65,7.45 38.63,7.45 LED.5 | v19.3,43 18.7,43 arc90 18.6,42.9 | 18.6,47.2 15.9,47.2 v15.05,46.35 | v32.68,30.08 32.68,32.18 33.8,33.3 v36.1,33.3 | ANT.5 49.92,7.15 BLUETOOTH.3 | U4.1 45.08,27.3 45.78,26.6 48.11,26.6 51.1,29.59 PROGRAM.1 | D5.C v12.3,26.1
  Bottom 0.254: 12.1,63.2 16.1,63.2 | 16.1,63.2 U1.21 | 10.1,42.8 10.1,36.68 5V.2 10.07,31.83 10.1,31.8 | 10.1,42.8 16.1,48.8 16.1,63.2 | 14.1,9.4 14.1,9.39 1117.1 16.11,8.65 C4.- 18.55,8.05 20,6.6 22,6.6 | 10.1,42.8 14.16,42.8 C1.- 15.05,41.91 v15.05,46.35 | C3.- 10.19,31.89 10.1,31.8 | U3.62 24.14,34.29 28.48,34.29 v32.68,30.08 35.1,27.67 U3.32 | 35.11,26.97 U3.32 | Q1.2 44.25,43.66 44.25,42.06 44.71,41.61 v45.06,41.61 | U1.5 27.34,62.41 26.35,62.41 26.12,62.64 26.12,63.78 26.35,64.01 27.34,64.01 U1.3 27.56,64.01 29.85,64.01 v30.08,63.78 30.49,63.37 34.48,63.37 C6.1 35.18,62.43 33.43,60.68 C2.1 33.09,60.76 Y1.GND | U3.81 28.6,43.8 29.1,44.3 34.1,44.3 | U3.99 37.6,43.8 37.1,44.3 34.1,44.3 | 34.1,44.3 v34.1,49.8 | U3.11 38.6,35.8 v36.1,33.3 | 19.91,72.3 C5.- 18.51,73.7 11.4,73.7 10.4,72.7 10.4,71.21 8.92,69.73 5.37,69.73 4.54,68.9 R11.1 4.54,64.07 5.41,63.2 12.1,63.2 | 19.91,72.3 19.91,73.4 20.81,74.3 30.2,74.3 | IC1.4 IC1.3 IC1.2 IC1.1 30.2,74.3 | 19.91,72.3 20.37,71.83 IC1.7 | 30.2,74.3 38.2,74.3 39.4,73.1 39.4,72.2 38,70.8 36.2,70.8 35.65,70.25 Q3.2 | BOOTLOAD2.2 45.03,71 43.2,71 40.1,67.9 v39.9,67.9 | 14.1,9.4 13.8,9.1 | v27,5.8 24.4,5.8 23.6,6.6 22,6.6 | v19.3,43 19.3,40.5 R24.1 R23.2 | ANT.5 ANT.2 46.81,18 | ANT.4 ANT.3 51.89,16.91 50.8,18 46.81,18 | 43.41,16.94 JP1.1 | JP1.9 22,14.96 22,6.6 | U3.32 35.1,25.55 35.85,24.8 39.6,24.8 v41.05,23.35 41.05,22.9 42.35,21.6 42.35,20.05 41.51,19.21 C7.1 40.94,19.21 40.1,20.05 39.9,20.05 39.25,20.7 39.09,20.7 C8.1 38.66,21.13 Y2.GND | LED.5 43.28,6.6 45.35,6.6 46.15,5.8 46.15,3.35 46.75,2.75 48.95,2.75 49.92,3.72 BLUETOOTH.3 | 12.1,63.2 12.1,61.85 11.8,61.55 11.8,57.8 11.06,57.07 6.57,57.07 CHARGE.2
  Bottom 0.254: 46.81,18 46.81,23.83 R9.1 47.53,23.87 47.99,24.33 47.99,26.48 51.1,29.59 PROGRAM.1 | 14.1,9.4 14.1,24.3 v12.3,26.1 12.3,29.6 10.1,31.8
  pour Bottom: 0,75.7 56.1,75.7 56.1,0 0,0
  pour Top: 0,75.7 56.1,75.7 56.1,0 0,0
GNDLED
  Top 0.254: LEDIN.4 32.8,79.4 28.3,83.9 28.3,86.05 29,86.75 32.75,86.75 | 32.75,86.75 42.8,86.75 | 42.8,86.75 52.7,86.75 D9.C | D8.C 42.8,85.25 42.8,86.75 | D10.C 32.75,85.25 32.75,86.75
  pour Top (isolate 0.254): 26.1,89.2 26.1,75.7 56.1,75.7 56.1,89.2
GNDSENSOR
  Top 0.254: SHT21.2 14.6,80.4 12.99,78.79 SENSOR.1
  Bottom 0.254: U2.7 21.4,82.7 22.1,82 22.1,80.7 21.8,80.4 21.2,80.4 19.59,78.79 SENSOR.1
  pour Top (isolate 0.254): 0,89.2 0,75.7 26.1,75.7 26.1,89.2
  pour Bottom (isolate 0.254): 0,89.2 0,75.7 26.1,75.7 26.1,89.2
N$1
  Top 0.254: U4.31 23.1,27.3 21.1,25.3 21.1,19.3 19.43,17.63 U$2.SIM_GND
N$2
  Top 0.254: U$2.SIM_VDD 19.34,16.46 19.79,16.46 22.08,18.75 22.08,24.69 23.91,26.52 24.36,26.52 25.05,27.2 25.05,30.86 24.36,31.55 23.45,31.55 U4.27
N$3
  Top 0.254: 19.11,13.94 U$2.SIM_RST 15.57,13.82 7.3,22.1 7.3,25 9.7,27.4 16.3,27.4 18.6,29.7 18.6,31.5 19.33,32.23 20.93,32.23 22.54,30.63 23.22,30.63 U4.28
N$4  (via drill 0.61)
  Top 0.254: v17.96,12.57 19.11,12.57 U$2.SIM_DATA | v18.65,21.72 19.06,22.13 19.06,27.36 21.19,29.49 23.22,29.49 U4.29
  Bottom 0.254: v17.96,12.57 17.96,13.26 18.65,13.94 v18.65,21.72
N$5
  Top 0.254: U4.39 38.35,21.5 42.15,17.7 42.15,14.6 43.95,12.8 ANT.1 49.35,9 51.2,7.15 51.2,3.5 50.3,2.6 26.3,2.6 22.6,6.3 22.6,12.8 25.63,15.83 JP1.8
N$6  (via drill 0.61)
  Top 0.254: 19.79,11.43 19.34,11.43 U$2.SIM_CLK 19.75,11.29 v20.81,12.34 | v20.02,20.35 20.02,26.72 21.65,28.35 23.22,28.35 U4.30
  Bottom 0.254: v20.02,20.35 20.81,19.56 v20.81,12.34
N$7  (via drill 0.61)
  Top 0.254: L-80.2 36.25,62.18 33.51,62.18 30.54,59.21 30.54,58.29 30.99,57.84 37.06,57.84 41.64,53.26 v42.42,53.26
  Bottom 0.254: v42.42,53.26 47.05,48.64 47.05,39.05 R13.2
N$8  (via drill 0.6, 0.61)
  Top 0.254: v51.6,49.8 51.6,49.3 51.1,48.8 47.1,48.8 46.6,48.3 v46,48.3 | v33.3,69.95 34.21,70.86 v40.59,70.86
  Bottom 0.254: U1.31 25.1,67.8 25.4,68.1 32.23,68.1 33.3,69.17 v33.3,69.95 | v40.59,70.86 40.59,72.29 41.91,73.61 46.77,73.61 54.3,66.07 54.3,63 52.1,60.8 52.1,58.8 53.85,57.05 53.85,50.29 53.36,49.8 | v46,48.3 42.7,48.3 41.7,47.3 41.7,43.7 41.35,43.35 41.35,40.55 41.1,40.3 U3.2 | 53.36,49.8 v51.6,49.8 | PROGRAM.4 53.36,39.87 53.36,49.8
N$9  (via drill 0.6, 0.61)
  Top 0.254: v52.8,52.7 53.85,53.75 53.85,59.35 v53.37,59.84 48.9,64.3 46.2,64.3 45.3,65.2 43.4,65.2 41.95,66.65 41.95,71.1 40.97,72.08 39.68,72.08 39.05,71.45 31.65,71.45 30.8,70.6 30.8,67.9 28.4,65.5 v24.7,65.5 | v43.5,55.3 44.1,54.7 44.1,45.4 v42.9,44.2 | v46.7,54.8 46.7,53.86 49.26,51.3 v50.1,51.3
  Bottom 0.254: v46.7,54.8 44,54.8 v43.5,55.3 | v53.37,59.84 54.45,58.75 54.45,37.31 52.21,35.07 PROGRAM.3 | v52.8,52.7 51.4,51.3 v50.1,51.3 | U1.30 24.3,65.9 v24.7,65.5 | U3.3 41.35,39.8 41.9,40.35 41.9,43.2 v42.9,44.2
N$10  (via drill 0.61)
  Top 0.254: U$1.SCK 17.51,39.78 18.19,39.78 18.65,39.32 18.65,38.79 v19.11,38.33 | v47.53,33.21 46.17,33.21 44.78,34.6 42.44,34.6 40.89,36.15 40.89,44.05 v40.59,44.35
  Bottom 0.254: v40.59,44.35 40.59,49.19 36.29,53.49 31.91,53.49 23.02,44.6 19.1,44.6 18.2,43.7 R24.2 18.42,39.78 18.42,39.02 v19.11,38.33 | 46.08,32 R7.1 46.13,31.8 v47.53,33.21
N$11  (via drill 0.6)
  Top 0.254: v47.1,62.8 47.1,58.08 48.2,56.98 48.2,54.3 49.7,52.8 51.1,52.8 54.45,49.45 54.45,21.65 53.5,20.7 51.57,20.7 | v37.6,31.3 40.1,28.8 v40.1,27.3 | v43.1,23.8 46.2,20.7 51.57,20.7 | U$1.DOUT 15.44,42.14 2.55,29.25 2.55,17.11 3.55,16.11 3.55,7.25 5.1,5.7 20.2,5.7 23.9,2 52.75,2 53.75,3 53.75,16.18 51.57,18.36 51.57,20.7
  Bottom 0.254: v47.1,62.8 45.3,61 42.17,61 BOOTLOAD1.1 | U3.22 38.1,30.3 37.6,30.8 v37.6,31.3 | v40.1,27.3 41.6,25.8 42.6,25.8 43.1,25.3 v43.1,23.8
N$12  (via drill 0.61)
  Top 0.254: v47.22,30.86 47.45,30.63 v47.45,27.59 | 17.51,37.72 U$1.DIN 18.15,37.75 19.1,36.8 19.1,35.8 19.47,35.43 v22.31,35.43
  Bottom 0.254: v47.22,30.86 46.08,29.72 R6.1 45.85,29.72 44.25,28.12 39.22,28.12 25.96,41.38 23.22,41.38 22.55,40.7 22.55,35.68 v22.31,35.43 | R9.2 46.85,26.98 v47.45,27.59
N$13
  Bottom 0.254: U1.7 28.5,60.8 29.41,61.71 Y1.IN 30.92,62.46 C2.2
N$14
  Bottom 0.254: U3.6 41.9,38.3 43.3,39.7 43.95,39.7 R2.2
N$15
  Bottom 0.254: R2.1 46.15,40.1 46.15,43.6 Q1.1
N$16
  Bottom 0.254: BOOTLOAD1.3 41.05,59.66 42.2,58.52 46.3,58.52 47.6,57.22 47.6,53.3 48.35,52.55 48.35,37.06 46.88,35.59 46.88,35.03 46.65,34.8 45.45,34.8 45.1,34.45 45.1,30.78 44.25,29.95 R6.2 43.2,30.8 U3.21
N$17  (via drill 0.6)
  Top 0.254: v39.1,42.3 38.1,41.3 v38.1,33.8 | v39.6,48.8 39.5,48.9 39.5,52.95 38.49,53.96 v38.49,54.02
  Bottom 0.254: R7.2 44.1,31.8 43.6,31.3 U3.20 39.1,31.3 38.1,32.3 v38.1,33.8 | v39.6,48.8 39.1,48.3 v39.1,42.3 | v38.49,54.02 40.83,56.36 BOOTLOAD1.5
N$18
  Top 0.254: R3.2 20.8,36.7 U4.26
N$19
  Top 0.254: BATTERY.1 SWITCH.1
  Bottom 0.254: D3.K 14.11,58.54 6.1,50.53 BATTERY.1
N$20
  Bottom 0.254: U3.19 42.1,31.8 44.1,33.8 R8.2
N$21
  Bottom 0.254: 20.48,58.52 U1.16 20.3,59.4 21.29,60.39 24.25,60.39 25.19,61.33 25.19,64.29 25.9,65 25.9,65.54 26.65,66.29 29.24,66.29 31.6,63.93 35.42,63.93 39,67.51 39,69.1 39.9,70 41.2,70 41.8,70.6 41.8,71.8 42.34,72.34 BOOTLOAD2.1
N$22
  Bottom 0.254: U1.15 21.16,58.29 21.16,57.84 21.62,57.38 32.23,57.38 33.3,58.45 35.8,58.45 36.8,59.45 36.8,62.77 BOOTLOAD2.3
N$23  (via drill 0.61)
  Top 0.254: BOOTLOAD2.5 45.19,65.9 47.1,65.9 47.9,66.7 47.9,72.6 46.26,74.24 31.04,74.24 28.8,72 28.8,69.1 27.6,67.9 23.8,67.9 22.54,66.63 22.54,63.2 v23.6,62.13
  Bottom 0.254: U1.17 19.76,60 20.84,61.08 22.55,61.08 v23.6,62.13
N$24
  Bottom 0.254: U1.8 28.45,60 28.64,59.81 Y1.OUT 32.01,59.81 32.3,59.52 34.29,59.52 C6.2
N$25
  Top 0.254: R26.1 16.5,62.4 16.1,62.8 6.83,62.8 CHARGE.1
  Bottom 0.254: CHARGE.1 7.63,61.07 D3.A
N$26  (via drill 0.61)
  Top 0.254: BOOTLOAD2.6 45.1,68.53 45.1,70.5 44.5,71.1 43.1,71.1 41.35,72.85 39.17,72.85 38.44,73.58 32.08,73.58 30,71.5 30,68.3 28.4,66.7 24.2,66.7 23.45,65.95 23.45,64.27 v23.58,64.14
  Bottom 0.254: 23.45,66.98 U1.29 23.5,64.22 v23.58,64.14 | R1.2 45.4,19.2 45.4,19.89 44.1,21.18 44.1,26.78 45.77,28.45 46.16,28.45 48.4,30.69 48.4,31.5 49.01,32.11 49.01,42.26 | BOOTLOAD2.6 50.6,63.03 50.6,59.4 48.2,57 48.2,53.7 49.01,52.89 49.01,42.26 | PGMSWITCH.1 49.01,42.26
N$27  (via drill 0.6)
  Top 0.254: D1.A R26.2 14.6,61.2 v14.6,56.5 | v8.4,47.7 5.7,47.7 v4.7,46.7
  Bottom 0.254: v14.6,56.5 15.1,56 15.1,49.3 13.5,47.7 v8.4,47.7 | LED.3 36.3,3.7 34.62,2.02 13.08,2.02 4,11.1 4,15.2 4.8,16 4.8,22.6 3.4,24 3.4,25.4 3.4,25.7 3.4,45.4 v4.7,46.7
N$28  (via drill 0.6)
  Top 0.254: Q2.1 23.1,48.65 v23.1,47.3 | R3.1 20.6,39.7 19.9,40.4 19.9,42.1 20.2,42.4 20.2,45.2 v19.6,45.8
  Bottom 0.254: v23.1,47.3 21.1,47.3 v19.6,45.8
N$29
  Bottom 0.254: 7,67.22 4.1V.1 6.66,67.52 6.37,67.23 6.37,64.63 R11.2 8.11,64.6 R10.1
N$30
  Bottom 0.254: U3.33 34.6,25.15 35.5,24.25 39.05,24.25 39.61,23.69 Y2.IN 41.19,21.35 C7.2
N$31
  Bottom 0.254: U3.34 34.1,24.3 35.48,22.92 37.1,22.92 | 37.1,22.92 Y2.OUT | C8.2 38.34,19.21 37.6,19.95 37.6,21.05 37.1,21.55 37.1,22.92
N$32  (via drill 0.6, 0.61)
  Top 0.254: v22.99,24.23 24.36,24.23 28.34,28.21 28.34,30.56 27.1,31.8 27.1,41.8 26.1,42.8 26.1,47.46 27.29,48.65 35.05,48.65 35.6,49.2 35.6,50.55 35.1,51.05 35.1,54.6 34.84,54.86 29.62,54.86 28.71,53.95 D7.C | v24.7,18.4 26.2,18.4 26.9,17.7 26.9,14.55 26.05,13.7 24.5,13.7 23.3,12.5 23.3,7.3 25.9,4.7 28,4.7 30,6.7 32.75,6.7 33.76,5.69 LED.2
  Bottom 0.254: v24.7,18.4 22.99,20.11 v22.99,24.23 22.24,24.98 R28.1
N$33  (via drill 0.61)
  Top 0.254: D4.C 36.48,53.72 36.59,53.61 v36.59,51.53
  Bottom 0.254: R25.1 16.45,28.8 17.4,29.75 17.4,32.2 17.8,32.6 19.5,32.6 21.2,34.3 21.2,35.65 21.8,36.25 21.8,41.8 31.53,51.53 v36.59,51.53
N$34  (via drill 0.61)
  Top 0.254: v20.93,41.15 20.93,53.49 20.71,53.72 D2.C
  Bottom 0.254: v20.93,41.15 20.93,36.12 20.5,35.68 20.5,34.6 19.25,33.35 17.3,33.35 16.5,32.55 R27.1 16.5,31.68
N$35  (via drill 0.6)
  Top 0.254: U$1.CS 15.74,36.66 v15.6,36.8 15.6,33.72 16.16,33.16 23.74,33.16 26.23,30.67 v26.23,29.19 | v47.7,34.8 48.1,34.8 48.6,34.3 48.6,32.8 47.6,31.8 45.72,31.8 44.42,33.1 42.23,33.1 39.17,36.16 39.17,40.17 40.1,41.1 40.1,42.95 39.25,43.8 37.1,43.8 34.6,41.3 34.6,37.65 29.7,32.75 v29.7,30.32
  Bottom 0.254: R23.1 v15.6,36.8 | 46.1,33.8 R8.1 46,34.11 47.01,34.11 v47.7,34.8 | v29.7,30.32 27.1,30.3 26.23,29.43 v26.23,29.19
N$36
  Bottom 0.254: U3.13 43.1,34.8 44.1,35.8 R12.1
N$37
  Bottom 0.254: R13.1 43.45,38.1 42.8,37.45 42.8,36.3 41.8,35.3 U3.12
N$38  (via drill 0.61)
  Top 0.254: R4.2 39.1,63.9 39.1,60.8 38.48,60.18 | 38.48,60.18 38.03,59.73 L-80.1 | v38.54,60.12 38.48,60.18
  Bottom 0.254: v38.54,60.12 40.14,58.52 41.28,58.52 41.97,57.84 41.97,55.73 42.6,55.1 42.6,54.5 42.9,54.2 43.1,54.2 44,53.3 45.6,53.3 47.7,51.2 47.7,37.97 46.08,36.35 46.08,35.89 R12.2
N$39
  Bottom 0.254: R28.2 22.24,29.14 22.9,29.8 U3.53
N$40
  Bottom 0.254: U3.46 28.1,24.8 27.1,23.8 R14.2
N$41
  Bottom 0.254: R15.2 29.3,21.1 28.6,21.8 U3.45
N$42  (via drill 0.61)
  Top 0.254: R29.2 22.08,49.72 22.08,43.43 23.22,42.29 U4.21 23.45,42.06 24.84,42.06 26.1,40.8 26.1,31.8 27.44,30.46 27.44,28.68 v24.36,25.6
  Bottom 0.254: v24.36,25.6 24.36,24 R14.1
N$43  (via drill 0.6)
  Top 0.254: U4.22 23.45,40.92 24.36,40.92 25.1,40.18 25.1,35.8 23.6,34.3 v18.8,34.3 | v24.2,20.4 24.2,19.7 21.6,17.1 21.6,14.8 22,14.4 22,11.8 20,9.8 17.7,9.8 6.6,20.9 6.6,25.6 10,29 v15,29
  Bottom 0.254: 27.2,19.8 27.34,19.66 R15.1 26.6,20.4 v24.2,20.4 | v18.8,34.3 16.6,34.3 15,32.7 v15,29
N$44
  Bottom 0.254: IC1.5 22.59,69.29 | 22.59,69.29 21.9,68.6 U1.27 | R5.2 22.59,70.8 22.59,69.29
N$45
  Bottom 0.254: U3.54 21.8,30.3 20,28.5 R25.2
N$46  (via drill 0.61)
  Top 0.254: U4.20 27.11,46.41 27.11,45.49 27.79,44.8 39.68,44.8 41.59,46.72 v42.89,46.72
  Bottom 0.254: Q1.3 44.94,45.72 43.94,46.72 v42.89,46.72
N$47  (via drill 0.6)
  Top 0.254: v36.6,29.3 36.6,31.8 37.6,32.8 39.1,32.8 41.1,30.8 41.1,26.3 41.6,25.8 44.17,25.8 v45.17,24.8 | v41.6,54.8 43.37,56.57 BOOTLOAD1.6 | v45.7,55.8 45.7,53.8 49.7,49.8 v50.1,49.8 | v34.6,56.9 30.2,56.9 29,58.1 29,60 33.4,64.4 v33.4,65.9 | 24.6,51.3 Q2.3 24.7,51.3 v27.1,51.3 | PGMSWITCH.3 51.86,47.34 53.1,46.1 53.1,33.7 51.93,32.53 PROGRAM.2
  Bottom 0.254: R16.2 45.17,21.95 v45.17,24.8 45.17,26.73 46.88,28.44 48.14,28.44 49.05,29.35 49.05,30.85 50.73,32.53 PROGRAM.2 | U3.30 36.1,28.8 v36.6,29.3 | PGMSWITCH.3 50.1,48.34 v50.1,49.8 | BOOTLOAD1.6 44.64,57.26 45.7,56.2 v45.7,55.8 | v27.1,51.3 31.6,55.8 34.6,55.8 | 34.6,55.8 36.83,55.8 37.24,55.39 37.24,53.6 38.04,52.8 40.6,52.8 41.6,53.8 v41.6,54.8 | Q3.3 35.7,71.9 34.7,70.9 34.7,69.4 33.4,68.1 v33.4,65.9 | v34.6,56.9 34.6,55.8
N$48
  Bottom 0.254: U3.55 21.45,30.8 20.8,30.15 19,30.15 18.3,30.85 R27.2
N$49
  Bottom 0.254: R30.1 15.9,65.3 16.3,64.9 17.4,64.9 17.8,65.3 17.8,66.1 18.2,66.5 19.4,66.5 20.3,65.6 22.2,65.6 22.7,66.1 U1.28 22.7,67.7 23.6,68.6 26.6,68.6 27.1,69.1 27.1,70 26.54,70.56 IC1.6
N$50
  Top 0.254: R17.2 38.35,51.45 U4.13
N$51  (via drill 0.6)
  Top 0.254: D6.A 40.5,51.8 R17.1 40.4,53.5 38.09,55.81 37.69,55.81 v27.4,55.8 | v21.3,3.3 19.8,4.8 4.35,4.8 1.6,7.55 1.6,29.9 6,34.3 6,39.65 16.05,49.7 v18.1,49.7
  Bottom 0.254: v27.4,55.8 24.2,55.8 v18.1,49.7 | v21.3,3.3 22,2.6 34.2,2.6 35,3.4 35,6.2 35.5,6.7 38,6.7 38.84,5.86 LED.4
N$52
  Bottom 0.254: 36.5,68 R31.1 37.55,68.75 Q3.1
N$53
  Bottom 0.254: U3.43 29.6,23.3 31.1,21.8 31.1,19.8 32.05,18.85 35.9,18.85 38.33,16.42 JP1.3
N$54
  Bottom 0.254: U3.44 29.1,22.8 30.4,21.5 30.4,19.4 31.5,18.2 34.9,18.2 35.79,17.31 JP1.4
N$55  (via drill 0.6)
  Top 0.254: v34.6,19.8 33.25,18.45 JP1.5
  Bottom 0.254: 32.14,13.03 R20.1 33.25,13.95 JP1.5 | U3.37 32.6,21.8 v34.6,19.8
N$56  (via drill 0.6)
  Top 0.254: v32.1,20.8 32.1,20.3 30.71,18.91 JP1.6
  Bottom 0.254: R19.2 27.34,13.03 27.34,13.49 27.95,14.1 29.35,14.1 30.71,15.46 JP1.6 | U3.38 v32.1,20.8
N$57  (via drill 0.6)
  Top 0.254: JP1.7 28.17,18.58 25.75,21 25.75,24.45 31.55,30.25 31.55,32.85 36.6,37.9 v36.6,40.8
  Bottom 0.254: v36.6,40.8 U3.97
N$58  (via drill 0.6)
  Top 0.254: RAIN.4 R21.2 24.1,10.7 24.1,12.3 24.45,12.65 32.95,12.65 34.55,14.25 34.55,17.7 36.1,19.25 v36.1,19.8
  Bottom 0.254: R21.2 25.05,9.83 27.11,9.83 RAIN.4 | U3.36 33.1,23.3 36.1,20.3 v36.1,19.8
N$59
  Bottom 0.254: R22.2 36.94,9.83 36.91,9.8 RAIN.1 34.91,11.61 37.1,13.8 38.8,13.8 39.6,14.6 39.6,17.28 38.85,18.03 37.62,18.03 37.1,18.55 37.1,20.3 33.6,23.8 U3.35
N$60  (via drill 0.6)
  Top 0.254: v15.8,21.5 15.7,21.6 D5.A | v21,8.5 21,6.4 v22.7,4.7
  Bottom 0.254: v22.7,4.7 23.7,3.7 28.6,3.7 29.6,4.7 LED.1 | v21,8.5 20.1,8.5 15.7,12.9 R18.1 15.7,21.4 v15.8,21.5
N$61
  Bottom 0.254: R31.2 34.7,65.11 34.2,64.61 32.22,64.61 29.74,67.09 U1.32
N$62  (via drill 0.6)
  Top 0.254: v34.65,29.3 34.65,27.6 36.2,26.05 38.85,26.05 40.55,24.35 41.45,24.35 42.2,23.6 42.2,22.65 47.75,17.1 v49.4,17.1 | v47.4,7.85 47.38,7.83 BLUETOOTH.2
  Bottom 0.254: U3.64 28.5,35.3 30.2,33.6 30.85,33.6 34.65,29.8 v34.65,29.3 | v49.4,17.1 49.4,15.25 51.1,13.55 51.1,11.85 47.4,8.15 v47.4,7.85
N$63
  Top 0.254: SHT21.1 13.47,81.33 SENSOR.2
  Bottom 0.254: U2.6 18.12,81.33 SENSOR.2
N$64
  Top 0.254: SHT21.6 13.47,83.87 SENSOR.3
  Bottom 0.254: U2.5 18.95,82 16.6,82 14.73,83.87 SENSOR.3
N$65
  Top 0.254: SHT21.5 14.6,84.7 12.89,86.41 SENSOR.4
  Bottom 0.254: U2.3 U2.2 17.44,86.41 SENSOR.4
N$66  (via drill 0.6)
  Top 0.254: v20,31.2 20,29.6 18.4,28 18.4,23.6 17.3,22.5 17.3,21.25 16.6,20.55 11.55,20.55 v11,20 | v3.7,22.3 3.7,24 v5.4,25.7
  Bottom 0.254: U3.63 22.95,34.8 20,31.85 v20,31.2 | BLUETOOTH.1 41.59,1.45 10.85,1.45 2.7,9.6 2.7,21.3 v3.7,22.3 | v5.4,25.7 5.4,24.3 6.2,23.5 6.2,22.5 8.7,20 v11,20
N$67
  Top 0.254: D10.A 32.6,82.35 38.75,82.35 39.93,81.17 LEDIN.3
N$68
  Top 0.254: D8.A 42.47,82.48 LEDIN.2
N$69
  Top 0.254: D9.A 45.01,80.51 LEDIN.1
N$70
  Bottom 0.254: BUTTON.1 46.72,6.9 50.95,6.9 52.46,5.39 BLUETOOTH.4

### Text on the board
tNames: VDD | SCL | GND | SDA | GND | MISO | GND | MOSI | +5V | SCK | RST | MISO | GND | MOSI | +5V | SCK | RST | 1280 / RST | GND | 328 / RST | RST | GND | GND | ANT | A0 | D46 | D47 | SDA | SCL | 3.3V | GND | D48 | GND | GND | D49 | Pwr | Anemo | Chrg | Netw | GND
bNames: VDD | SCL | SDA | GND
tValues: + | - | - | + | D0 | D1